# Altium schematic sheet Board-PowerSupply.SchDoc: =ProjectTitle
size 297 x 209 mm; Address1: Address1; Address2: Address2; Address3: Address3; Address4: Address4; SheetNumber: ?; SheetTotal: ?; Scale: 1:1; DocumentType: Схема электрическая принципиальная
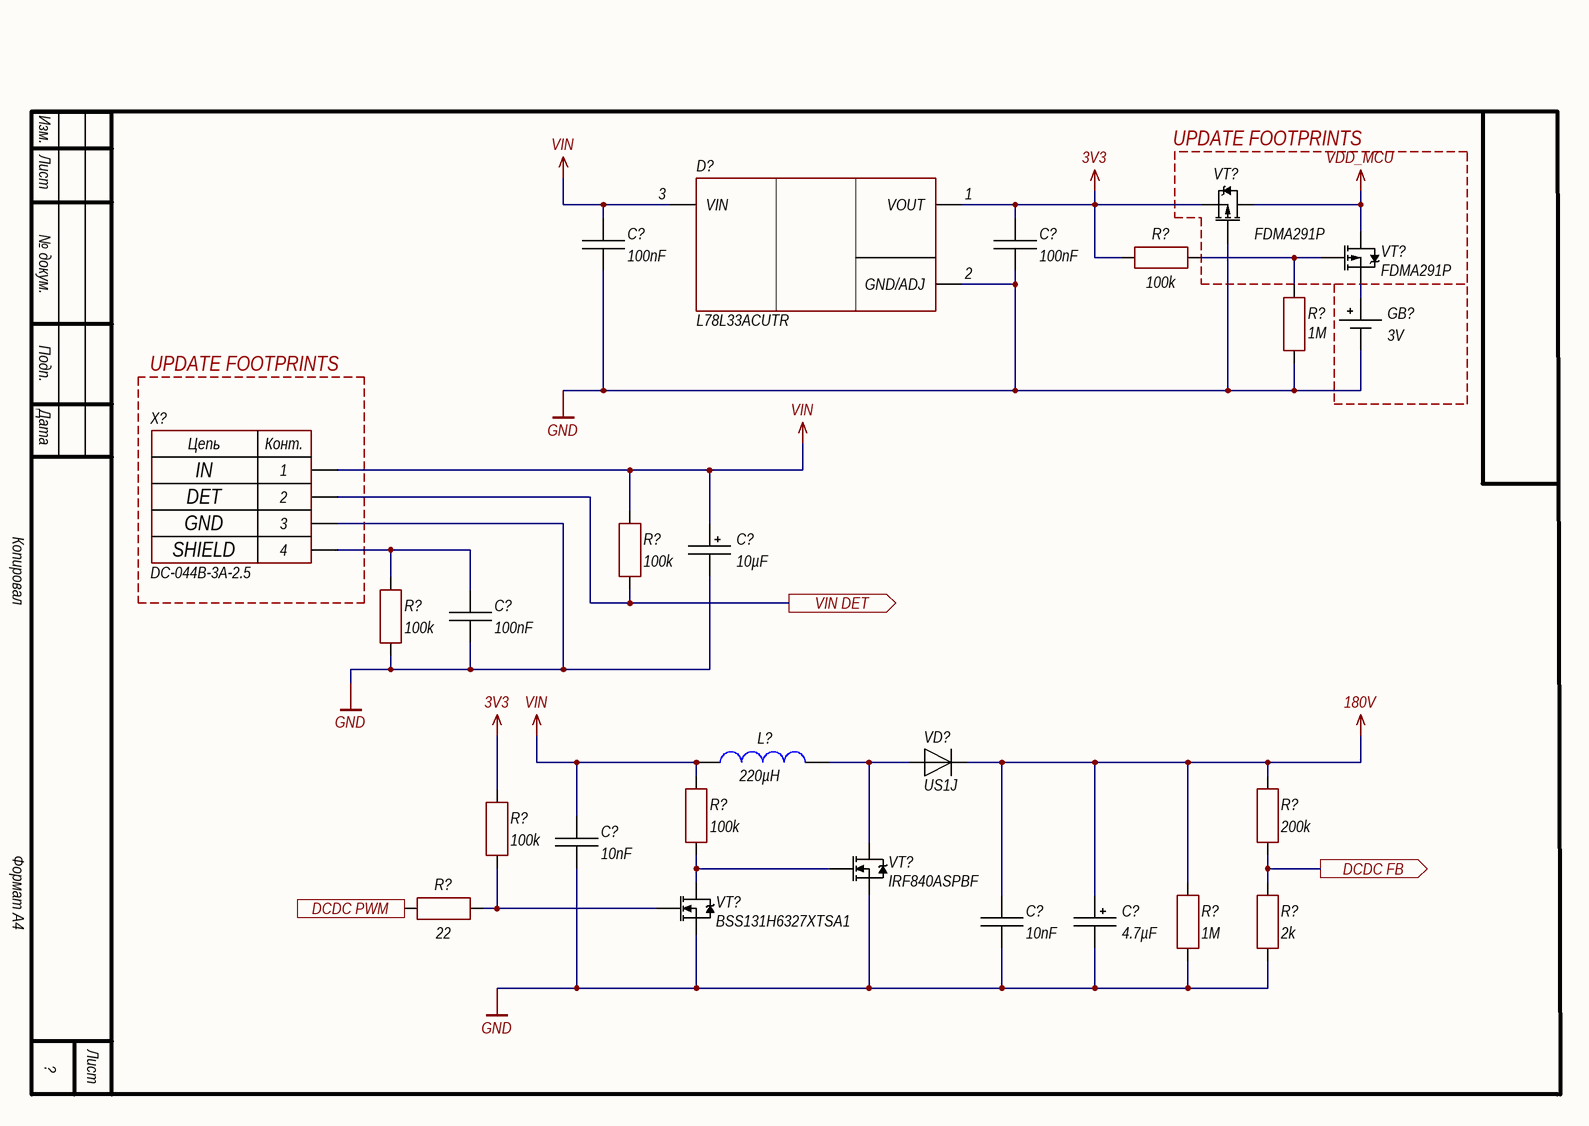
[diagram p0: Board-PowerSupply.SchDoc]

## Parts
(Parts that share a designator on the sheet are numbered #1, #2 ... from top to bottom, then left to right.)
C?#1  100nF  [CH0402C]
C?#2  100nF  [CH0402C]
C?#3  10µF  [TANTAL_A]
C?#4  100nF  [CH0402C]
C?#5  10nF  [CH1210C]
C?#6  4.7µF  [D8C3.5H12]
C?#7  10nF  [CH1210C]
D?  L78L33ACUTR  [SOT89_123]
GB?  3V  [BAT: 18650_single]
L?  220µH  [IND: SDR0403]
R?#1  100k  [CH0402R]
R?#2  1M  [CH0402R]
R?#3  100k  [CH0402R]
R?#4  100k  [CH0402R]
R?#5  100k  [CH0402R]
R?#6  200k  [CH0603R]
R?#7  100k  [CH0402R]
R?#8  22  [CH0402R]
R?#9  1M  [CH1206R]
R?#10  2k  [CH0603R]
VD?  US1J  [SMA]
VT?#1  FDMA291P  [8-HSOF]
VT?#2  FDMA291P  [8-HSOF]
VT?#3  IRF840ASPBF  [DPAK]
VT?#4  BSS131H6327XTSA1  [SOT23_123]
X?  DC-044B-3A-2.5  [CON: DC-044B-3A-2.5]

## Ports
DCDC FB (out), DCDC PWM (in), VIN DET (out)

## Nets
3V3: C?#2.2 D?.1(VOUT) R?#1.2 R?#7.2 VT?#1.3(S)
180V: C?#6.1 C?#7.2 R?#6.2 R?#9.2 VD?.2
GND: C?#1.1 C?#2.1 C?#3.2 C?#4.1 C?#5.1 C?#6.2 C?#7.1 D?.2(GND/ADJ) GB?.1 R?#2.2 R?#4.1 R?#9.1 R?#10.1 VT?#1.1(G) VT?#3.3(S) VT?#4.3(S) X?.3
VDD_MCU: VT?#1.2(D) VT?#2.2(D)
VIN: C?#1.2 C?#3.1 C?#5.2 D?.3(VIN) L?.2 R?#3.2 R?#5.2 X?.1
DCDC FB: R?#6.1 R?#10.2 ; port DCDC FB
DCDC PWM: R?#8.2 ; port DCDC PWM
VIN DET: R?#3.1 X?.2 ; port VIN DET
NetC?#4_2: C?#4.2 R?#4.2 X?.4
NetGB?_2: GB?.2 VT?#2.3(S)
NetL?_1: L?.1 VD?.1 VT?#3.2(D)
NetR?#1_1: R?#1.1 R?#2.1 VT?#2.1(G)
NetR?#5_1: R?#5.1 VT?#3.1(G) VT?#4.2(D)
NetR?#7_1: R?#7.1 R?#8.1 VT?#4.1(G)

## Notes on the sheet
- UPDATE FOOTPRINTS
- IN
- DET
- GND
- SHIELD
- Изм.
- Лист
- № докум.
- Подп.
- Дата
- Копировал
- Формат А4
- (in symbol 4-Connector) Цепь; Конт.

## Library data of the parts
C?#1 C?#2 C?#4 = Capacitor: Manufacturer: CCTC; Model: TCC0402X7R104K250AT; HelpURL: https://lcsc.com/product-detail/Multilayer-Ceramic-Capacitors-MLCC-SMD-SMT_CCTC-TCC0402X7R104K250AT_C466234.html; ComponentKind: X7R, 50V; Value: 100nF
C?#3 = TantalCap: Manufacturer: *; Model: *; HelpURL: *; ComponentKind: *; Value: 10µF
C?#5 C?#7 = Capacitor: Manufacturer: AVX A Corp.; Model: 1210AC103KAT1A; HelpURL: https://www.terraelectronica.ru/product/859825; ComponentKind: X7R, 1KV; Value: 10nF
C?#6 = AlumCap: Manufacturer: *; Model: *; HelpURL: *; ComponentKind: *; Value: 4.7µF
D? = L78LxxACUTR: Step-down; Manufacturer: ST Microelectronics; Model: L78L33ACUTR; HelpURL: https://www.st.com/resource/en/datasheet/l78l.pdf; ComponentKind: SOT-89, 100mA
GB? = Battery: Manufacturer: *; Model: *; HelpURL: *; ComponentKind: *; Value: 3V
L? = Inductor: Manufacturer: Bourns GmbH.; Model: SDR0403-221KL; HelpURL: https://www.terraelectronica.ru/product/992838; ComponentKind: 4.4Ohm, 220mA; Value: 220µH
R?#1 R?#3-R?#5 R?#7 R?#8 = Resistor: Manufacturer: Uniroyal Elec; Model: 0402WGF1003TCE; HelpURL: https://lcsc.com/product-detail/Chip-Resistor-Surface-Mount_UNI-ROYAL-Uniroyal-Elec-0402WGF1003TCE_C25741.html; ComponentKind: ±1%
  R?#1 R?#3-R?#5 R?#7: Value: 100k
  R?#8: Value: 22
R?#2 = Resistor: Manufacturer: YAGEO; Model: RC0402JR-071ML; HelpURL: https://lcsc.com/product-detail/Chip-Resistor-Surface-Mount_1MR-105-5_C93949.html; ComponentKind: ±5%; Value: 1M
R?#6 R?#9 R?#10 = Resistor: Manufacturer: *; Model: *; HelpURL: *; ComponentKind: *
  R?#6: Value: 200k
  R?#9: Value: 1M
  R?#10: Value: 2k
VD? = Diod: Manufacturer: China; ComponentKind: 600V, 1A; Model: US1J; HelpURL: https://www.chipdip.ru/product/us1j
VT?#1 VT?#2 = P-chanel: Mosfet; Manufacturer: Fairchild Semiconductor; Model: FDMA291P; ComponentKind: -1V, -20V, -6.6A, MicroFET2x2; HelpURL: https://www.chipdip.ru/product/fdma291p
VT?#3 = N-chanel: Mosfet; Manufacturer: Vishay; Model: IRF840ASPBF; ComponentKind: 500V, 2-4V, 8A; HelpURL: https://www.chipdip.ru/product/irf840as
VT?#4 = N-chanel: Mosfet; Manufacturer: Infineon Technologies Ag; Model: BSS131H6327XTSA1; ComponentKind: 240V. 1.8V, 100mA; HelpURL: https://www.terraelectronica.ru/product/1112834
X? = 4-Connector: Model: DC-044B-3A-2.5; Manufacturer: *; HelpURL: *; ComponentKind: *